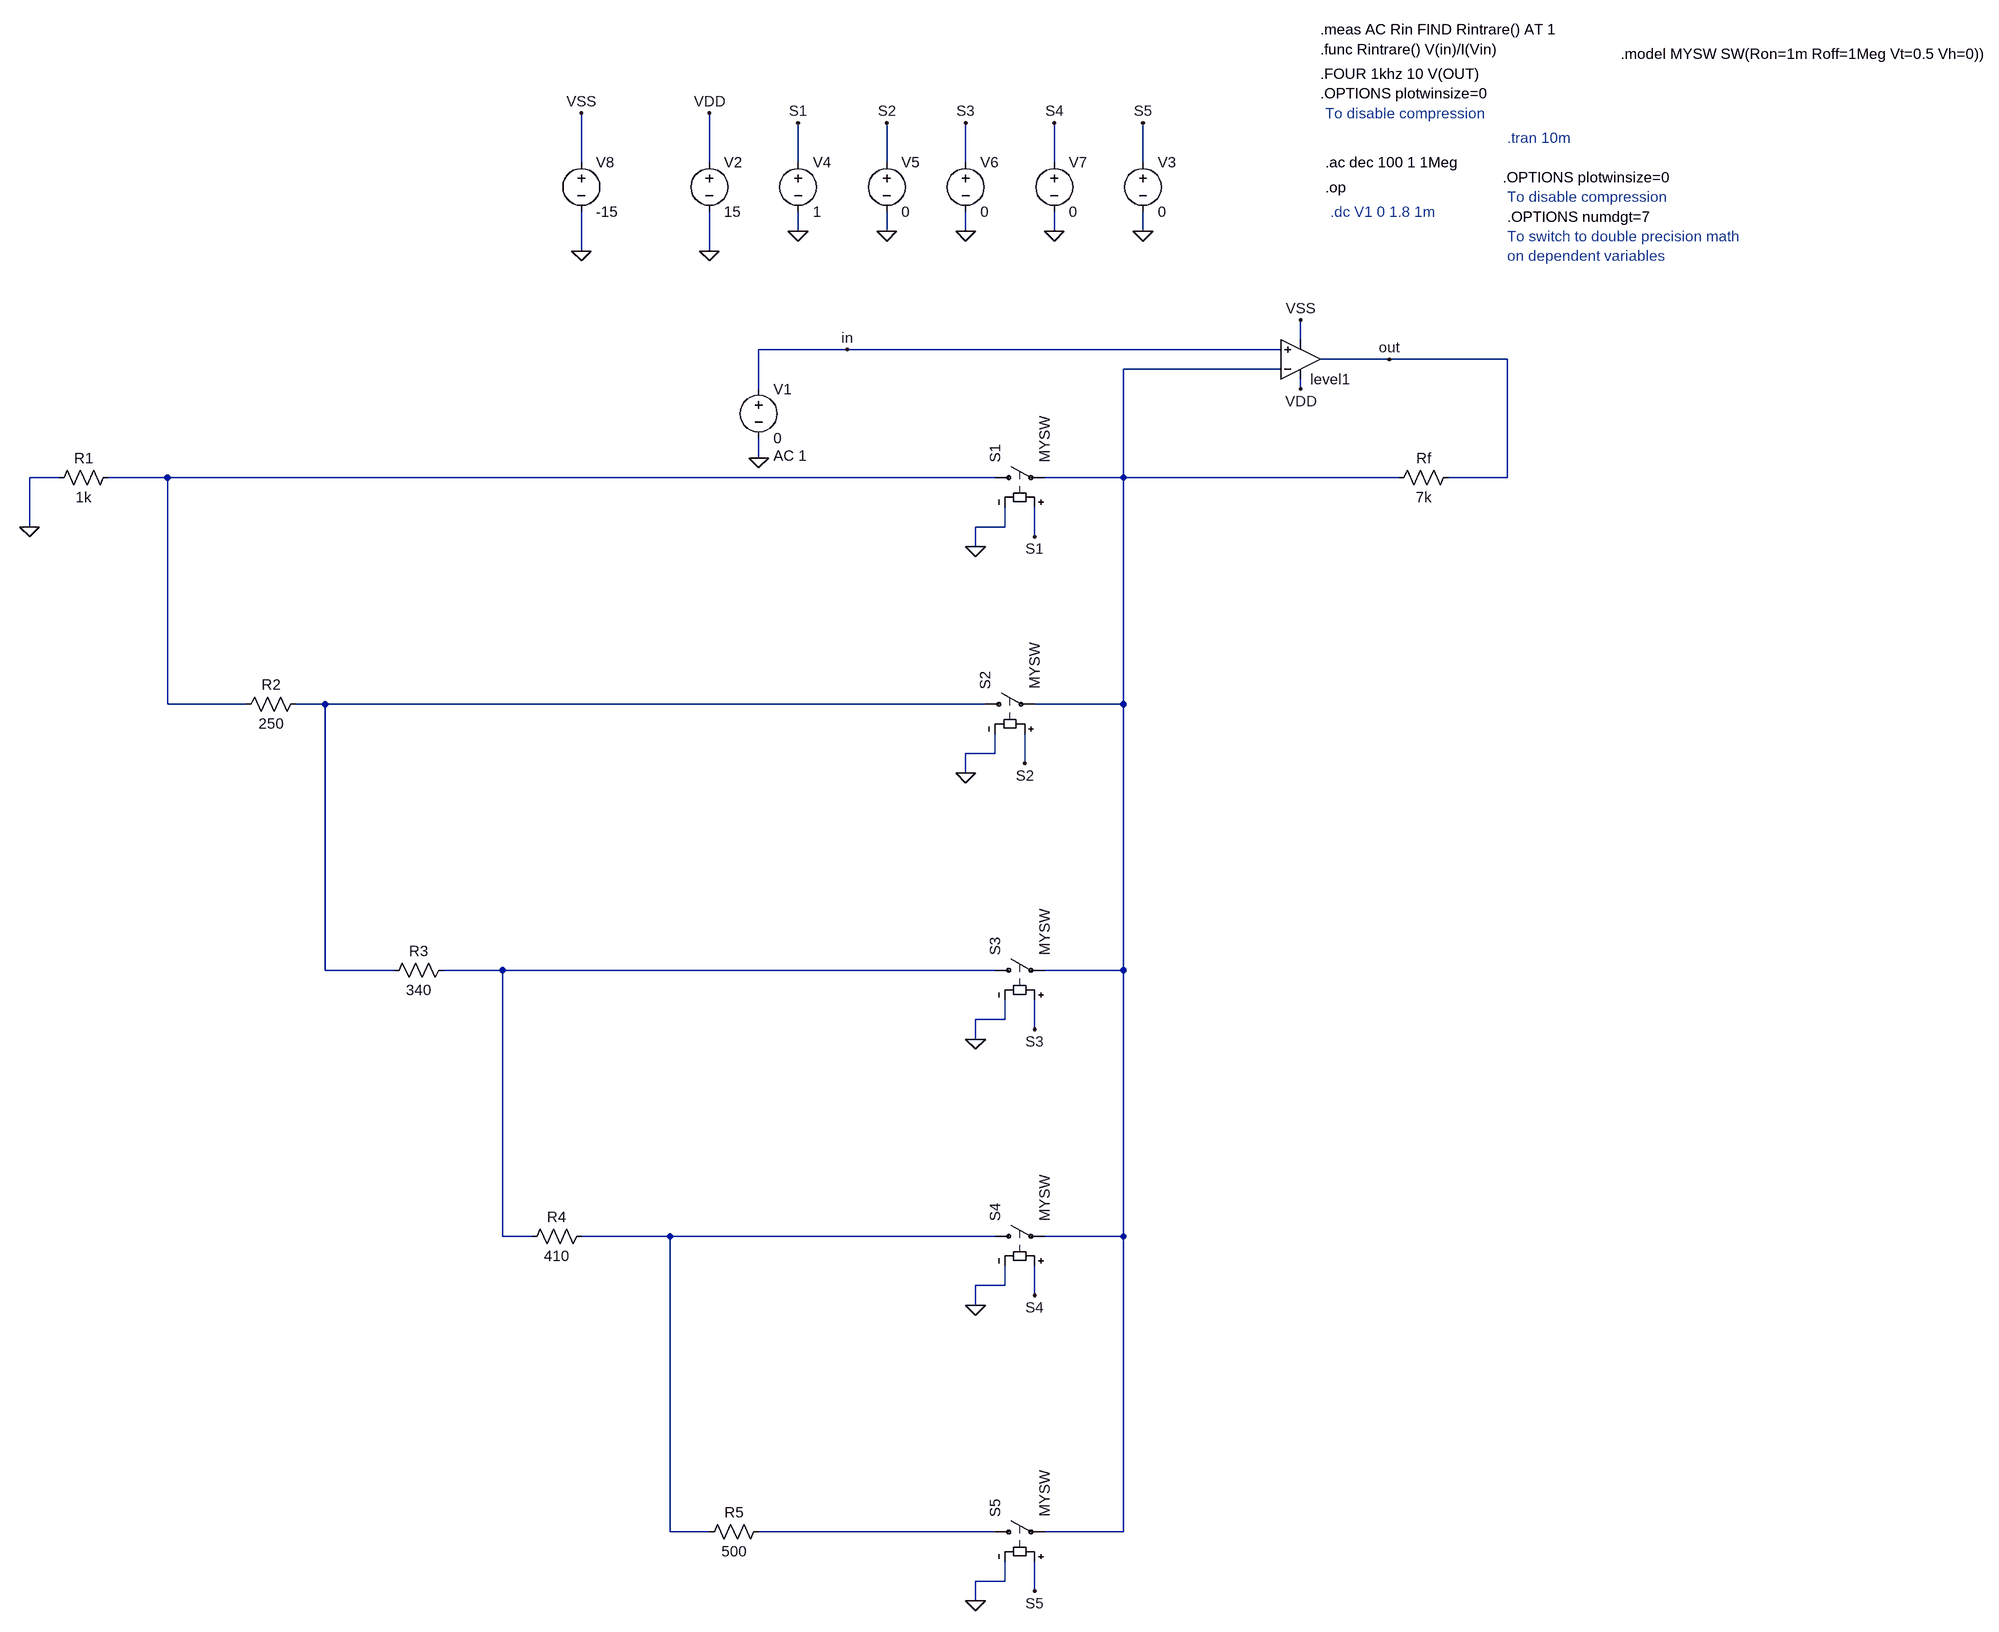
[diagram p0: schematic tb_PGA_serie_AO_ideal_switchIdeal.asc]
tb_PGA_serie_AO_ideal_switchIdeal.asc, the LTspice schematic file:
Version 4
SHEET 1 1820 2436
WIRE -1360 -240 -1360 -320
WIRE -1152 -240 -1152 -320
WIRE -1008 -240 -1008 -304
WIRE -864 -240 -864 -304
WIRE -736 -240 -736 -304
WIRE -592 -240 -592 -304
WIRE -448 -240 -448 -304
WIRE -1008 -128 -1008 -160
WIRE -864 -128 -864 -160
WIRE -736 -128 -736 -160
WIRE -592 -128 -592 -160
WIRE -448 -128 -448 -160
WIRE -1360 -96 -1360 -160
WIRE -1152 -96 -1152 -160
WIRE -192 48 -192 16
WIRE -928 64 -1072 64
WIRE -224 64 -928 64
WIRE -48 80 -160 80
WIRE 144 80 -48 80
WIRE -224 96 -480 96
WIRE -1072 128 -1072 64
WIRE -192 128 -192 112
WIRE -1072 240 -1072 208
WIRE -2208 272 -2256 272
WIRE -2032 272 -2128 272
WIRE -688 272 -2032 272
WIRE -480 272 -480 96
WIRE -480 272 -608 272
WIRE -32 272 -480 272
WIRE 144 272 144 80
WIRE 144 272 48 272
WIRE -2256 352 -2256 272
WIRE -672 352 -672 320
WIRE -672 352 -720 352
WIRE -624 368 -624 320
WIRE -720 384 -720 352
WIRE -2032 640 -2032 272
WIRE -1904 640 -2032 640
WIRE -1776 640 -1824 640
WIRE -704 640 -1776 640
WIRE -480 640 -480 272
WIRE -480 640 -624 640
WIRE -688 720 -688 688
WIRE -688 720 -736 720
WIRE -640 736 -640 688
WIRE -736 752 -736 720
WIRE -1776 1072 -1776 640
WIRE -1664 1072 -1776 1072
WIRE -1488 1072 -1584 1072
WIRE -688 1072 -1488 1072
WIRE -480 1072 -480 640
WIRE -480 1072 -608 1072
WIRE -672 1152 -672 1120
WIRE -672 1152 -720 1152
WIRE -624 1168 -624 1120
WIRE -720 1184 -720 1152
WIRE -1488 1504 -1488 1072
WIRE -1440 1504 -1488 1504
WIRE -1216 1504 -1360 1504
WIRE -688 1504 -1216 1504
WIRE -480 1504 -480 1072
WIRE -480 1504 -608 1504
WIRE -672 1584 -672 1552
WIRE -672 1584 -720 1584
WIRE -624 1600 -624 1552
WIRE -720 1616 -720 1584
WIRE -1216 1984 -1216 1504
WIRE -1152 1984 -1216 1984
WIRE -688 1984 -1072 1984
WIRE -480 1984 -480 1504
WIRE -480 1984 -608 1984
WIRE -672 2064 -672 2032
WIRE -672 2064 -720 2064
WIRE -624 2080 -624 2032
WIRE -720 2096 -720 2064
FLAG -1152 -96 0
FLAG -1152 -320 VDD
FLAG -1072 240 0
FLAG -1008 -128 0
FLAG -1008 -304 S1
FLAG -864 -128 0
FLAG -864 -304 S2
FLAG -736 -128 0
FLAG -736 -304 S3
FLAG -592 -128 0
FLAG -592 -304 S4
FLAG -48 80 out
FLAG -192 128 VDD
FLAG -192 16 VSS
FLAG -448 -128 0
FLAG -448 -304 S5
FLAG -2256 352 0
FLAG -928 64 in
FLAG -1360 -96 0
FLAG -1360 -320 VSS
FLAG -624 368 S1
FLAG -720 384 0
FLAG -640 736 S2
FLAG -736 752 0
FLAG -624 1168 S3
FLAG -720 1184 0
FLAG -624 1600 S4
FLAG -720 1616 0
FLAG -624 2080 S5
FLAG -720 2096 0
DATAFLAG -480 96 ""
DATAFLAG 0 80 ""
DATAFLAG 144 80 ""
SYMBOL voltage -1152 -256 R0
WINDOW 123 0 0 Left 2
WINDOW 39 0 0 Left 2
SYMATTR InstName V2
SYMATTR Value 15
SYMBOL voltage -1072 112 R0
WINDOW 123 24 124 Left 2
WINDOW 39 0 0 Left 2
SYMATTR Value2 AC 1
SYMATTR InstName V1
SYMATTR Value 0
SYMBOL res -2224 288 R270
WINDOW 0 32 56 VTop 2
WINDOW 3 0 56 VBottom 2
SYMATTR InstName R1
SYMATTR Value 1k
SYMBOL voltage -1008 -256 R0
WINDOW 123 0 0 Left 2
WINDOW 39 0 0 Left 2
SYMATTR InstName V4
SYMATTR Value 1
SYMBOL voltage -864 -256 R0
WINDOW 123 0 0 Left 2
WINDOW 39 0 0 Left 2
SYMATTR InstName V5
SYMATTR Value 0
SYMBOL voltage -736 -256 R0
WINDOW 123 0 0 Left 2
WINDOW 39 0 0 Left 2
SYMATTR InstName V6
SYMATTR Value 0
SYMBOL voltage -592 -256 R0
WINDOW 123 0 0 Left 2
WINDOW 39 0 0 Left 2
SYMATTR InstName V7
SYMATTR Value 0
SYMBOL res 64 256 R90
WINDOW 0 0 56 VBottom 2
WINDOW 3 32 56 VTop 2
SYMATTR InstName Rf
SYMATTR Value 7k
SYMBOL res -1680 1088 R270
WINDOW 0 32 56 VTop 2
WINDOW 3 0 56 VBottom 2
SYMATTR InstName R3
SYMATTR Value 340
SYMBOL res -1920 656 R270
WINDOW 0 32 56 VTop 2
WINDOW 3 0 56 VBottom 2
SYMATTR InstName R2
SYMATTR Value 250
SYMBOL res -1456 1520 R270
WINDOW 0 32 56 VTop 2
WINDOW 3 0 56 VBottom 2
SYMATTR InstName R4
SYMATTR Value 410
SYMBOL voltage -448 -256 R0
WINDOW 123 0 0 Left 2
WINDOW 39 0 0 Left 2
SYMATTR InstName V3
SYMATTR Value 0
SYMBOL res -1168 2000 R270
WINDOW 0 32 56 VTop 2
WINDOW 3 0 56 VBottom 2
SYMATTR InstName R5
SYMATTR Value 500
SYMBOL sw -704 272 R270
SYMATTR InstName S1
SYMATTR Value MYSW
SYMBOL sw -720 640 R270
SYMATTR InstName S2
SYMATTR Value MYSW
SYMBOL sw -704 1072 R270
SYMATTR InstName S3
SYMATTR Value MYSW
SYMBOL sw -704 1504 R270
SYMATTR InstName S4
SYMATTR Value MYSW
SYMBOL sw -704 1984 R270
SYMATTR InstName S5
SYMATTR Value MYSW
SYMBOL voltage -1360 -256 R0
WINDOW 123 0 0 Left 2
WINDOW 39 0 0 Left 2
SYMATTR InstName V8
SYMATTR Value -15
SYMBOL OpAmps\\UniversalOpAmp1 -192 80 M180
SYMATTR InstName level1
SYMATTR Value2 Avol=1Meg GBW=100Meg Vos=0
TEXT -152 -240 Left 2 !.ac dec 100 1 1Meg
TEXT -152 -200 Left 2 !.op
TEXT 144 -280 Left 2 ;.tran 10m
TEXT 136 -216 Left 2 !.OPTIONS plotwinsize=0
TEXT 144 -184 Left 2 ;To disable compression
TEXT 144 -152 Left 2 !.OPTIONS numdgt=7
TEXT 144 -120 Left 2 ;To switch to double precision math\non dependent variables
TEXT -160 -456 Left 2 !.meas AC Rin FIND Rintrare() AT 1
TEXT -160 -424 Left 2 !.func Rintrare() V(in)/I(Vin)
TEXT -160 -384 Left 2 !.FOUR 1khz 10 V(OUT)
TEXT -160 -352 Left 2 !.OPTIONS plotwinsize=0
TEXT -152 -320 Left 2 ;To disable compression
TEXT -144 -160 Left 2 ;.dc V1 0 1.8 1m
TEXT 328 -416 Left 2 !.model MYSW SW(Ron=1m Roff=1Meg Vt=0.5 Vh=0))

The netlist it stands for:
* tb_PGA_serie_AO_ideal_switchIdeal.asc
V2 VDD 0 15
V1 in 0 0 AC 1
R1 0 N002 1k
V4 S1 0 1
V5 S2 0 0
V6 S3 0 0
V7 S4 0 0
Rf out N001 7k
R3 N003 N004 340
R2 N002 N003 250
R4 N004 N005 410
V3 S5 0 0
R5 N005 N006 500
S1 N002 N001 S1 0 MYSW
S2 N003 N001 S2 0 MYSW
S3 N004 N001 S3 0 MYSW
S4 N005 N001 S4 0 MYSW
S5 N006 N001 S5 0 MYSW
V8 VSS 0 -15
Xlevel1 in N001 VDD VSS out level1 Avol=1Meg GBW=100Meg Vos=0 En=0 Enk=0 In=0 Ink=0 Rin=500Meg  ; pins In+ In- V+ V- OUT
.ac dec 100 1 1Meg
.op
* .tran 10m
.OPTIONS plotwinsize=0
* To disable compression
.OPTIONS numdgt=7
* To switch to double precision math
* on dependent variables
.meas AC Rin FIND Rintrare() AT 1
.func Rintrare() V(in)/I(Vin)
.FOUR 1khz 10 V(OUT)
.OPTIONS plotwinsize=0
* To disable compression
* .dc V1 0 1.8 1m
.model MYSW SW(Ron=1m Roff=1Meg Vt=0.5 Vh=0))
.lib UniversalOpAmp1.lib
.backanno
.end